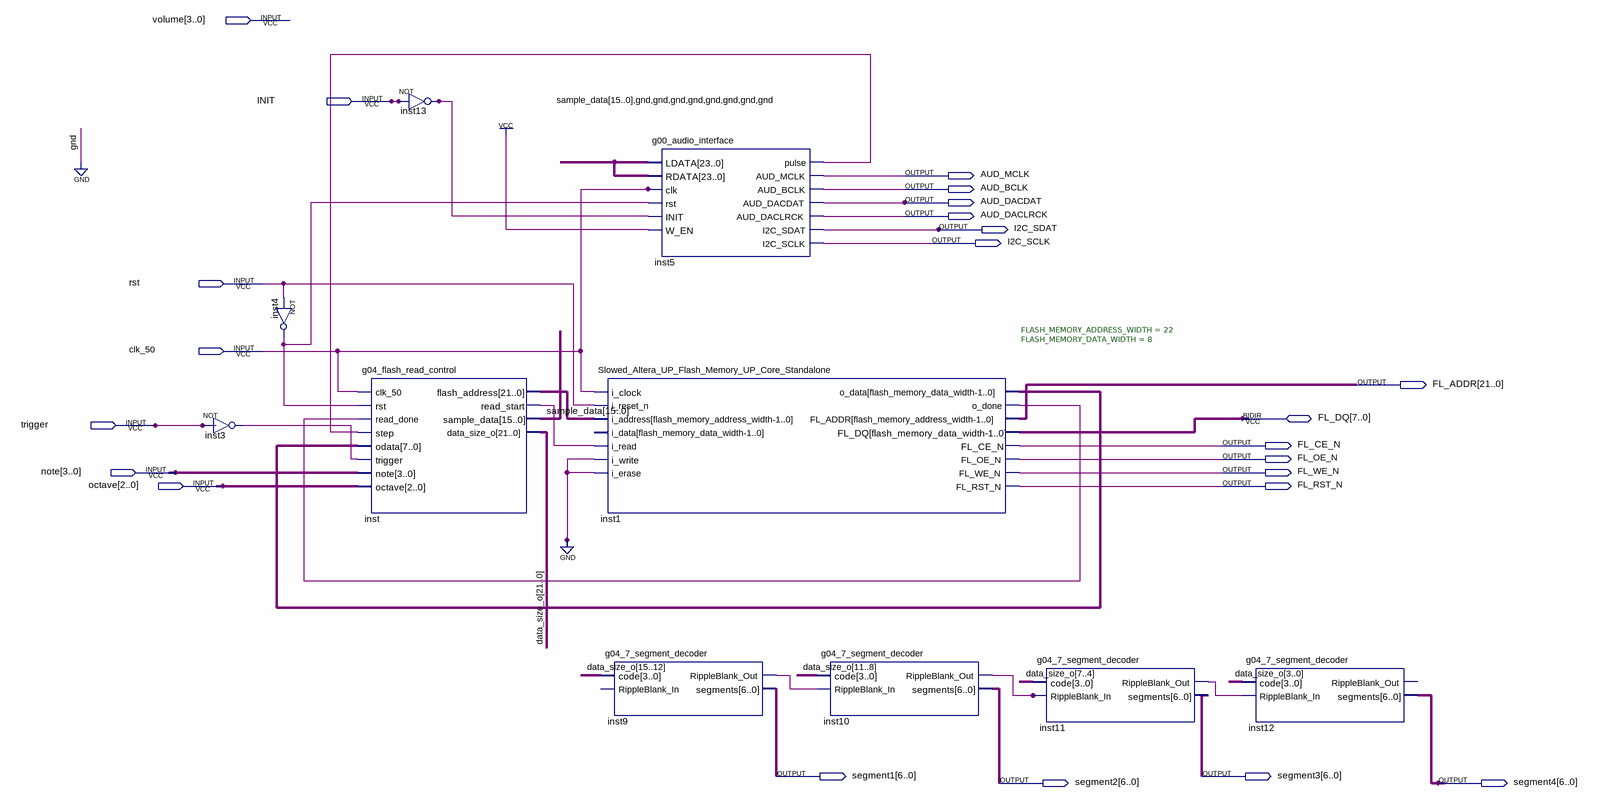
[diagram p0: schematic sheet]
// Quartus schematic g04_altera_display.bdf as structural Verilog: 10 symbols, 23 pins
module g04_altera_display (
  input  [3:0] volume,
  input  INIT,
  input  rst,
  input  clk_50,
  input  trigger,
  input  [3:0] note,
  input  [2:0] octave,
  inout  [7:0] FL_DQ,
  output AUD_MCLK,
  output AUD_BCLK,
  output AUD_DACDAT,
  output AUD_DACLRCK,
  output I2C_SDAT,
  output I2C_SCLK,
  output [21:0] FL_ADDR,
  output FL_CE_N,
  output FL_OE_N,
  output FL_WE_N,
  output FL_RST_N,
  output [6:0] segment1,
  output [6:0] segment3,
  output [6:0] segment2,
  output [6:0] segment4
);

  wire inst1_o_done, inst3_out, inst4_out, inst5_pulse, inst9_rippleblank_out, inst10_rippleblank_out,
       inst11_rippleblank_out, inst13_out, inst_read_start;
  wire [7:0] inst1_o_data;
  wire [15:0] sample_data;
  wire [21:0] data_size_o, inst_flash_address;

  not inst3 (inst3_out, trigger);
  not inst4 (inst4_out, rst);
  g04_flash_read_control inst (
    .clk_50(clk_50), .rst(inst4_out), .read_done(inst1_o_done), .step(inst5_pulse), .odata(inst1_o_data),
    .trigger(inst3_out), .note(note), .octave(octave), .flash_address(inst_flash_address),
    .read_start(inst_read_start), .sample_data(sample_data), .data_size_o(data_size_o));
  not inst13 (inst13_out, INIT);
  Slowed_Altera_UP_Flash_Memory_UP_Core_Standalone #(.FLASH_MEMORY_ADDRESS_WIDTH(22), .FLASH_MEMORY_DATA_WIDTH(8)) inst1 (
    .i_clock(clk_50), .i_reset_n(rst), .i_address(inst_flash_address), .i_read(inst_read_start),
    .i_write(1'b0), .i_erase(1'b0), .o_data(inst1_o_data), .o_done(inst1_o_done), .FL_ADDR(FL_ADDR),
    .FL_CE_N(FL_CE_N), .FL_OE_N(FL_OE_N), .FL_WE_N(FL_WE_N), .FL_RST_N(FL_RST_N), .FL_DQ(FL_DQ));  // open: i_data
  g04_7_segment_decoder inst9 (
    .code(data_size_o[15:12]), .RippleBlank_Out(inst9_rippleblank_out), .segments(segment1));  // open: RippleBlank_In
  g00_audio_interface inst5 (
    .LDATA({sample_data, {8{1'b0}}}), .RDATA({sample_data, {8{1'b0}}}), .clk(clk_50), .rst(inst4_out),
    .INIT(inst13_out), .W_EN(1'b1), .pulse(inst5_pulse), .AUD_MCLK(AUD_MCLK), .AUD_BCLK(AUD_BCLK),
    .AUD_DACDAT(AUD_DACDAT), .AUD_DACLRCK(AUD_DACLRCK), .I2C_SDAT(I2C_SDAT), .I2C_SCLK(I2C_SCLK));
  g04_7_segment_decoder inst10 (
    .code(data_size_o[11:8]), .RippleBlank_In(inst9_rippleblank_out),
    .RippleBlank_Out(inst10_rippleblank_out), .segments(segment2));
  g04_7_segment_decoder inst11 (
    .code(data_size_o[7:4]), .RippleBlank_In(inst10_rippleblank_out),
    .RippleBlank_Out(inst11_rippleblank_out), .segments(segment3));
  g04_7_segment_decoder inst12 (
    .code(data_size_o[3:0]), .RippleBlank_In(inst11_rippleblank_out), .segments(segment4));  // open: RippleBlank_Out
endmodule
